# EAGLE design 555Astable (EAGLE 9.6.2)
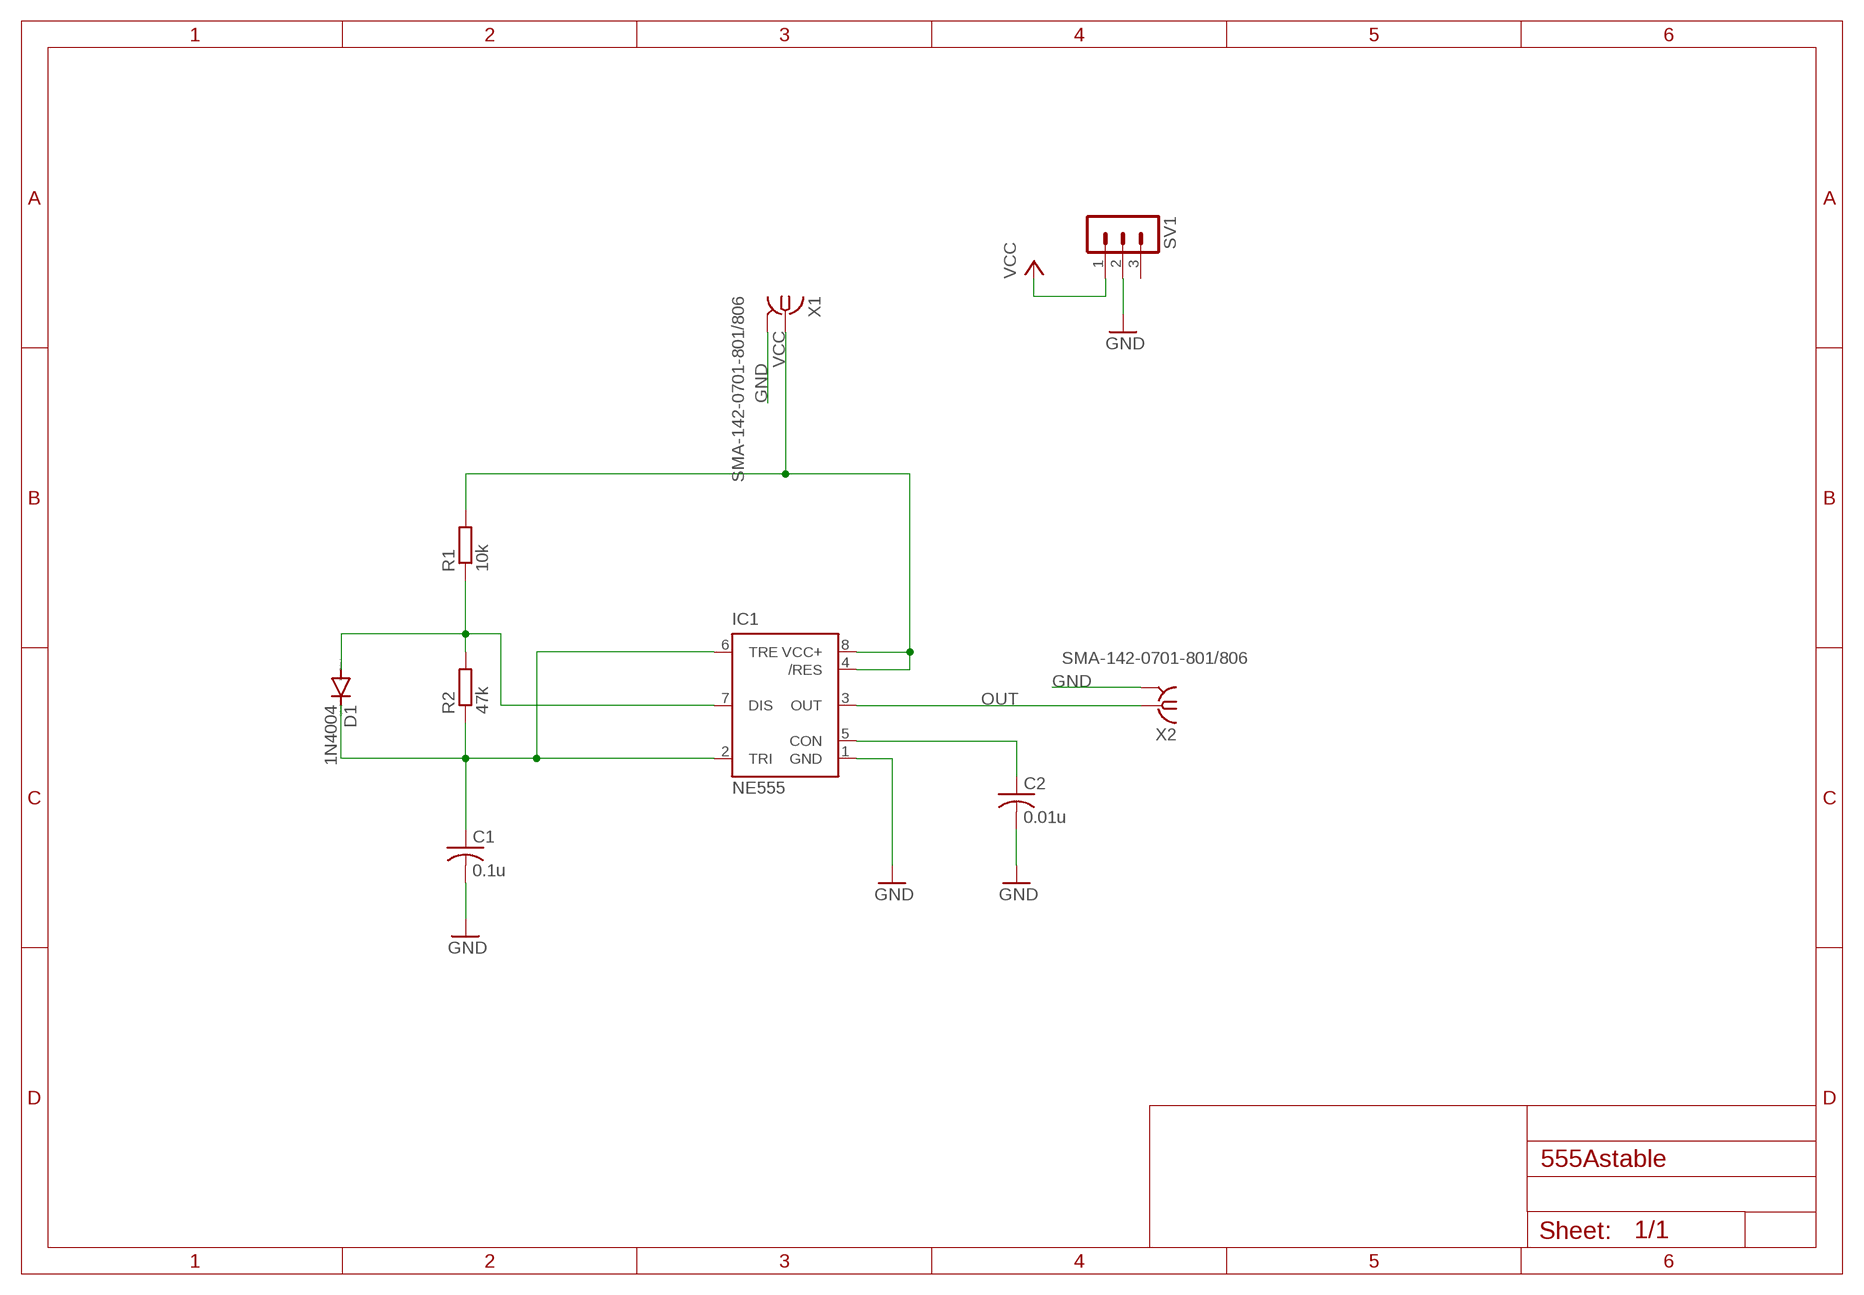
[diagram p0: schematic, sheet 1]

## Parts
C1  0.1u  C-USC0504  [C0504]
C2  0.01u  C-USC0504  [C0504]
D1  1N4004  [DO41-10]
IC1  NE555  [DIL-08]
R1  10k  R-EU_R0805  [R0805]
R2  47k  R-EU_R0805  [R0805]
SV1  MA03-1  [MA03-1]
X1  SMA-142-0701-801/806  [J502-ND-142-0701-801/806]
X2  SMA-142-0701-801/806  [J502-ND-142-0701-801/806]

## Nets
GND: C1.2 C2.2 IC1.1(GND) SV1.2 X1.G@1 X1.G@2 X1.G@3 X1.G@4 X2.G@1 X2.G@2 X2.G@3 X2.G@4
N$1: C2.1 IC1.5(CON)
N$2: C1.1 D1.C IC1.2(TRI) IC1.6(TRE) R2.1
N$4: D1.A IC1.7(DIS) R1.1 R2.2
OUT: IC1.3(OUT) X2.1
VCC: IC1.4(/RES) IC1.8(VCC+) R1.2 SV1.1 X1.1
Unconnected: SV1.3

## Library data of the parts
C1 C2 = rcl:C-US: CAPACITOR, American symbol; SPICEPREFIX: C
D1 = diode:1N4004: DIODE general purpose rectifier, 1 A
IC1 = st-microelectronics:NE555: General purpose bipolar Timer; MF: Arrow Electronics; MPN: NE555N; OC_FARNELL: 1467742; OC_NEWARK: 89K1486
R1 R2 = rcl:R-EU_: RESISTOR, European symbol; SPICEPREFIX: R
SV1 = con-lstb:MA03-1: PIN HEADER; OC_FARNELL: unknown; OC_NEWARK: unknown
X1 X2 = con-coax:SMA-: SMA 50 Ohm End Launch Jack Receptacle - Round Contact Johnson Components Source: www.johnsoncomponents.com .. J502-ND.pdf; MF: JOHNSON COMPONENTS; MPN: 142-0701-801; OC_FARNELL: 1608592; OC_NEWARK: 90F2624

## Board
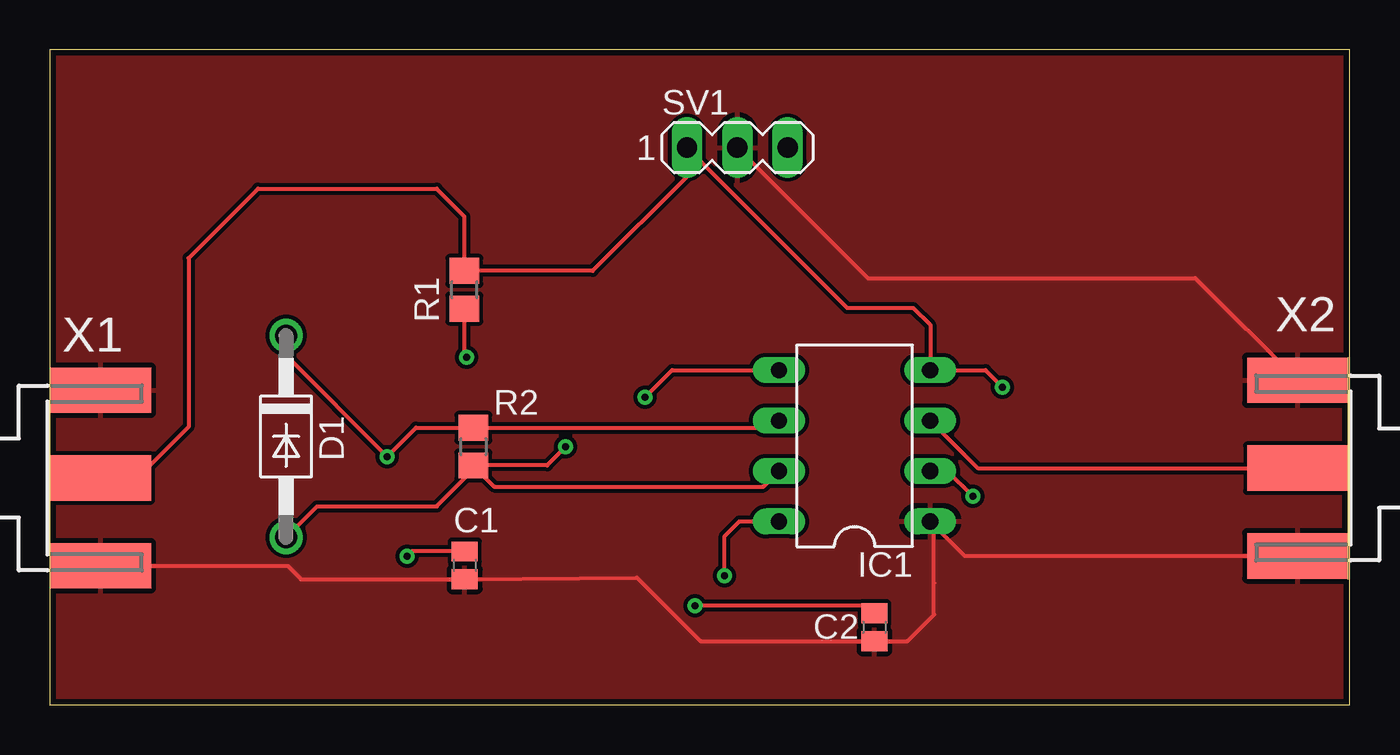
[diagram p1: board, top side]
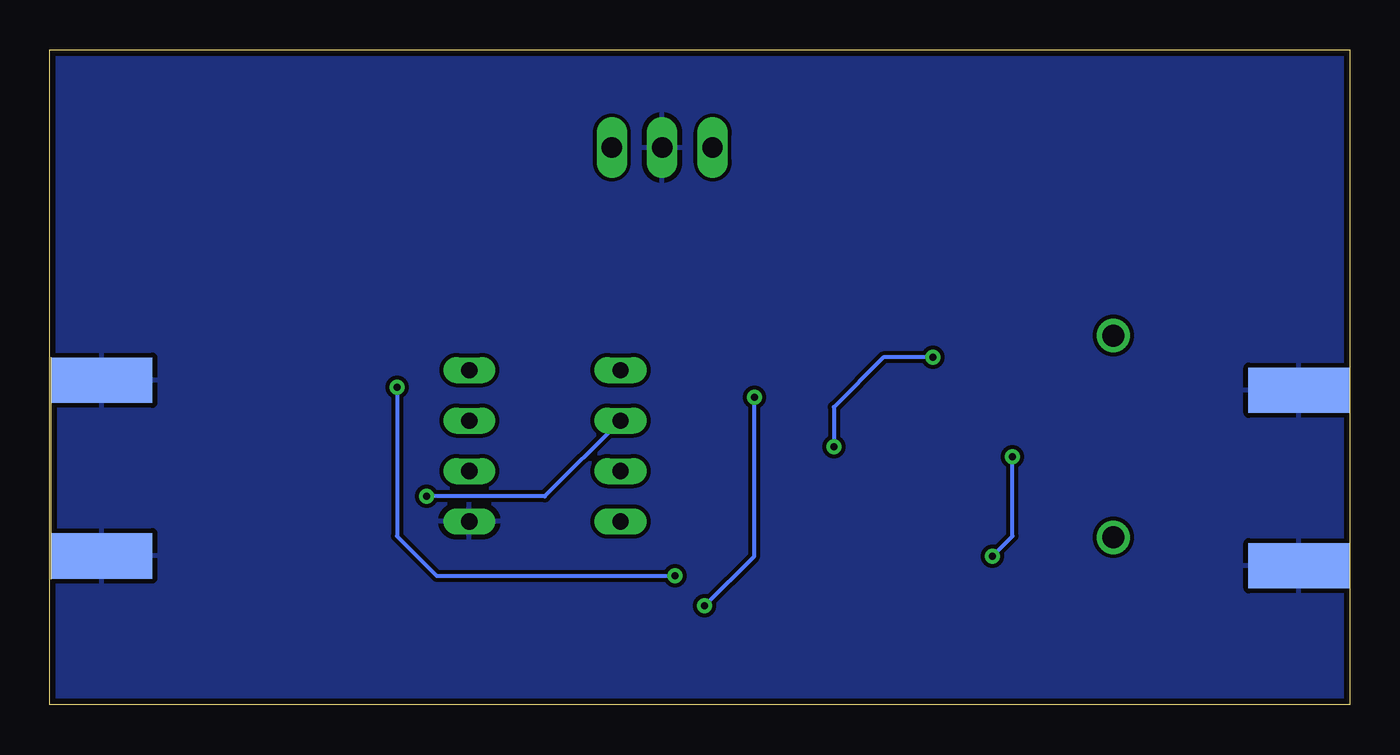
[diagram p2: board, bottom side, seen from below]

Size 65.5 x 33 mm. Coordinates in mm from the lower left corner, seen from the top.
Outline: 0,0 65.5,0 65.5,33 0,33 0,0
Copper layers (1*16): Top 0.035mm / dielectric 1.5mm / Bottom 0.035mm
Design rules "default *": minimum track width 0.2mm, minimum drill 0.35mm, track to track 0.2mm, track to pad 0.2mm, pad to pad 0.2mm, via to via 0.2mm, smd to smd 0.2mm, copper to edge 0.3mm, drill to drill 0.3mm, minimum pad ring 10mil, minimum via ring 8mil, stop-mask expansion 4mil, vias tented up to drill 0mil, thermal gap 10mil

### Footprints (pad centres in the part's own frame; a part is rotated, then mirrored left to right if it is on the bottom)
C0504 = smd 1 x 1.3: 1 -0.7,0; 2 0.7,0
DO41-10 = drill 1.118: A 5.08,0; C -5.08,0
DIL-08 = drill 0.813 long: 1 -3.81,-3.81; 2 -1.27,-3.81; 3 1.27,-3.81; 4 3.81,-3.81; 5 3.81,3.81; 6 1.27,3.81; 7 -1.27,3.81; 8 -3.81,3.81
R0805 = smd 1.3 x 1.5: 1 -0.95,0; 2 0.95,0
MA03-1 = drill 1.016 long: 1 -2.54,0; 2 0,0; 3 2.54,0
J502-ND-142-0701-801/806 = smd 5.08 x 2.286: 1 2.565,0; G@1 2.565,4.42; G@2 2.565,-4.42 | smd 5.08 x 2.286 bottom: G@3 2.565,4.42; G@4 2.565,-4.42

### Placement (x,y rotation side)
C1  20.91,7.03 270 top
C2  41.55,3.91 270 top
D1  11.91,13.52 270 top
IC1  40.55,13.05 90 top
R1  20.89,20.91 90 top
R2  21.34,13.01 270 top
SV1  34.64,28.07 0 top
X1  0,11.43 0 top
X2  65.43,11.93 180 top

### Tracks (layer width: path | path; a pad name or v marks a point on that pad's centre or on a via)
GND
  Top 0.2: 12.67,6.33 C1.2 | 44.55,6.14 44.55,4.55 43.21,3.21 C2.2 41.5,3.21
  Top 0.203: C1.2 29.59,6.41 32.79,3.21 41.5,3.21 | X1.G@4 11.99,7.01 12.67,6.33 | IC1.1 44.55,9.05 | 44.55,9.05 46.09,7.51 X2.G@3 | 44.55,6.14 44.55,9.05 | SV1.2 41.21,21.5 57.71,21.5 X2.G@4
  pour Top: 0,0 0,33 65.5,33 65.5,0
  pour Bottom: 0,0 0,33 65.5,33 65.5,0
N$1  (via drill 0.35)
  Top 0.203: C2.1 41.16,5 v32.5,5 | v30,15.5 31.36,16.86 IC1.5
  Bottom 0.203: v32.5,5 30,7.5 v30,15.5
N$2  (via drill 0.35)
  Top 0.203: C1.1 18.23,7.73 v18,7.5 | D1.C 11.91,17.6 v17,12.51 v17,12.5 18.46,13.96 R2.1 36.38,13.96 IC1.6 | v46.5,10.5 45.22,11.78 IC1.2
  Bottom 0.203: v18,7.5 17,8.5 v17,12.5 | IC1.6 40.56,10.5 v46.5,10.5
N$4  (via drill 0.35)
  Top 0.2: 13.47,10 19.5,10 | R1.1 20.89,17.61 v21,17.5
  Top 0.203: D1.A 13.47,10 | 19.5,10 21.34,11.84 R2.2 | R2.2 22.4,11 35.96,11 IC1.7 | v26,13 25.06,12.06 R2.2
  Bottom 0.203: v21,17.5 23.5,17.5 26,15 v26,13
OUT
  Top 0.203: IC1.3 46.75,11.93 X2.1
VCC  (via drill 0.35)
  Top 0.2: 19.5,26 20.89,24.61 R1.2 27.36,21.86 32.1,26.6 SV1.1
  Top 0.203: 19.5,26 10.5,26 7,22.5 7,14 4.43,11.43 X1.1 | SV1.1 40.17,20 43.5,20 44.36,19.14 IC1.4 47.14,16.86 v48,16 | v34,6.5 34,8.5 34.74,9.24 IC1.8
  Bottom 0.203: v48,16 48,8.5 46,6.5 v34,6.5